# Altium schematic sheet ProcessorSupport.SchDoc
size 420 x 297 mm; SheetNumber: 7; SheetTotal: 10; PageSetup: Record=PageOptions|CenterHorizontal=True|CenterVertical=True|PrintScale=0.96|XCorrection=1.00|YCorrection=1.00|PrintKind=1|BorderSize=5000000|LeftOffset=0|BottomOffset=0|Orientation=2|PaperLength=4318|PaperWidth=2794|Scale=100|PaperSource=7|PrintQuality=600|MediaType=1|DitherType=10|PaperKind=11" x 17"|PrintScaleMode=1
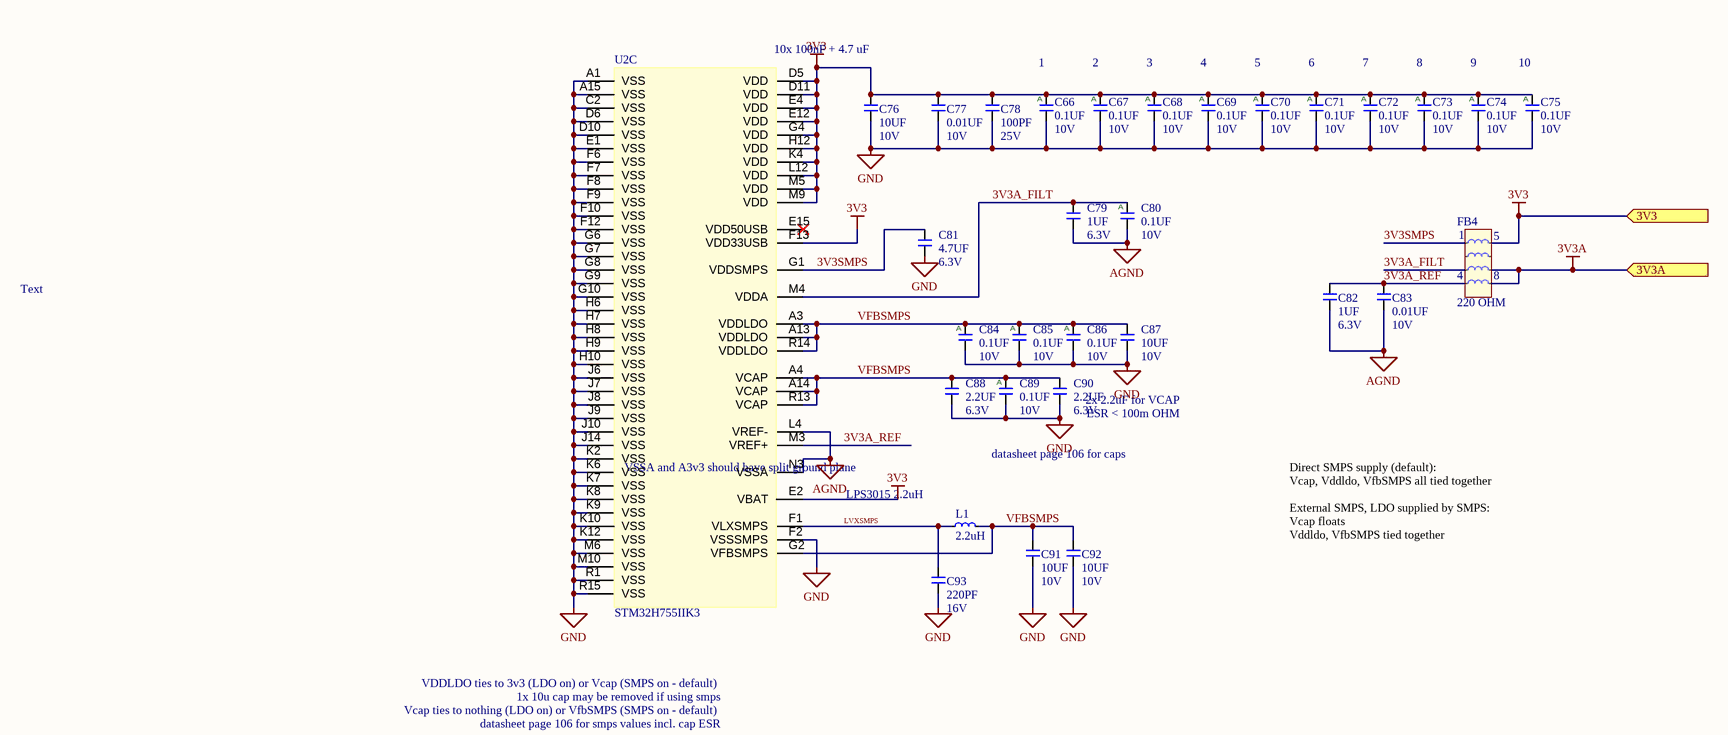
[diagram p0: ProcessorSupport.SchDoc]

## Parts
C66  value 0.1UF  Voltage: 10V  [C0201Y]  (hidden comment: __Template_Cap_Auto)
C67  value 0.1UF  Voltage: 10V  [C0201Y]  (hidden comment: __Template_Cap_Auto)
C68  value 0.1UF  Voltage: 10V  [C0201Y]  (hidden comment: __Template_Cap_Auto)
C69  value 0.1UF  Voltage: 10V  [C0201Y]  (hidden comment: __Template_Cap_Auto)
C70  value 0.1UF  Voltage: 10V  [C0201Y]  (hidden comment: __Template_Cap_Auto)
C71  value 0.1UF  Voltage: 10V  [C0201Y]  (hidden comment: __Template_Cap_Auto)
C72  value 0.1UF  Voltage: 10V  [C0201Y]  (hidden comment: __Template_Cap_Auto)
C73  value 0.1UF  Voltage: 10V  [C0201Y]  (hidden comment: __Template_Cap_Auto)
C74  value 0.1UF  Voltage: 10V  [C0201Y]  (hidden comment: __Template_Cap_Auto)
C75  value 0.1UF  Voltage: 10V  [C0201Y]  (hidden comment: __Template_Cap_Auto)
C76  value 10UF  Voltage: 10V  [C0402]  (hidden comment: __Template_Cap)
C77  value 0.01UF  Voltage: 10V  [C0201Y]  (hidden comment: __Template_Cap)
C78  value 100PF  Voltage: 25V  [C0201Y]  (hidden comment: __Template_Cap)
C79  value 1UF  Voltage: 6.3V  [C0201]  (hidden comment: __Template_Cap)
C80  value 0.1UF  Voltage: 10V  [C0201Y]  (hidden comment: __Template_Cap_Auto)
C81  value 4.7UF  Voltage: 6.3V  [C0402]  (hidden comment: __Template_Cap)
C82  value 1UF  Voltage: 6.3V  [C0201]  (hidden comment: __Template_Cap)
C83  value 0.01UF  Voltage: 10V  [C0201Y]  (hidden comment: __Template_Cap)
C84  value 0.1UF  Voltage: 10V  [C0201Y]  (hidden comment: __Template_Cap_Auto)
C85  value 0.1UF  Voltage: 10V  [C0201Y]  (hidden comment: __Template_Cap_Auto)
C86  value 0.1UF  Voltage: 10V  [C0201Y]  (hidden comment: __Template_Cap_Auto)
C87  value 10UF  Voltage: 10V  [C0402]  (hidden comment: __Template_Cap)
C88  value 2.2UF  Voltage: 6.3V  [C0201]  (hidden comment: __Template_Cap)
C89  value 0.1UF  Voltage: 10V  [C0201Y]  (hidden comment: __Template_Cap_Auto)
C90  value 2.2UF  Voltage: 6.3V  [C0201]  (hidden comment: __Template_Cap)
C91  value 10UF  Voltage: 10V  [C0402]  (hidden comment: __Template_Cap)
C92  value 10UF  Voltage: 10V  [C0402]  (hidden comment: __Template_Cap)
C93  value 220PF  Voltage: 16V  [C0201Y]  (hidden comment: __Template_Cap)
FB4  value 220 OHM  [FB_ARRAY_BLA31AG221SN4D]  (hidden comment: FB_ARRAY_BLA31AG221SN4D)
L1  value 2.2uH  [IND_LPS3015-152MRB]  (hidden comment: __Template_Inductor)
U2  MFG P/N: STM32H755IIK3  [BGS201C65P15X15_1000X1000X60]  (hidden comment: MCU_STM32H755IIK3)  (part C of 3)

## Ports
3V3 (in), 3V3A (in)

## Nets
3V3: C66.1 C67.1 C68.1 C69.1 C70.1 C71.1 C72.1 C73.1 C74.1 C75.1 C76.1 C77.1 C78.1 FB4.5 U2.D5(VDD) U2.D11(VDD) U2.E2(VBAT) U2.E4(VDD) U2.E12(VDD) U2.F13(VDD33USB) U2.G4(VDD) U2.H12(VDD) U2.K4(VDD) U2.L12(VDD) U2.M5(VDD) U2.M9(VDD) ; port 3V3
3V3A: FB4.7 FB4.8 ; port 3V3A
AGND: C79.2 C80.2 C82.2 C83.2 U2.L4(VREF-) U2.N3(VSSA)
GND: C66.2 C67.2 C68.2 C69.2 C70.2 C71.2 C72.2 C73.2 C74.2 C75.2 C76.2 C77.2 C78.2 C81.2 C84.2 C85.2 C86.2 C87.2 C88.2 C89.2 C90.2 C91.1 C92.1 C93.2 U2.A1(VSS) U2.A15(VSS) U2.C2(VSS) U2.D6(VSS) U2.D10(VSS) U2.E1(VSS) U2.F2(VSSSMPS) U2.F6(VSS) U2.F7(VSS) U2.F8(VSS) U2.F9(VSS) U2.F10(VSS) U2.F12(VSS) U2.G6(VSS) U2.G7(VSS) U2.G8(VSS) U2.G9(VSS) U2.G10(VSS) U2.H6(VSS) U2.H7(VSS) U2.H8(VSS) U2.H9(VSS) U2.H10(VSS) U2.J6(VSS) U2.J7(VSS) U2.J8(VSS) U2.J9(VSS) U2.J10(VSS) U2.J14(VSS) U2.K2(VSS) U2.K6(VSS) U2.K7(VSS) U2.K8(VSS) U2.K9(VSS) U2.K10(VSS) U2.K12(VSS) U2.M6(VSS) U2.M10(VSS) U2.R1(VSS) U2.R15(VSS)
3V3A_FILT: C79.1 C80.1 FB4.3 U2.M4(VDDA)
3V3A_REF: C82.1 C83.1 FB4.4 U2.M3(VREF+)
3V3SMPS: C81.1 FB4.1 U2.G1(VDDSMPS)
LVXSMPS: C93.1 L1.1 U2.F1(VLXSMPS)
VFBSMPS: C84.1 C85.1 C86.1 C87.1 C88.1 C89.1 C90.1 C91.2 C92.2 L1.2 U2.A3(VDDLDO) U2.A4(VCAP) U2.A13(VDDLDO) U2.A14(VCAP) U2.G2(VFBSMPS) U2.R13(VCAP) U2.R14(VDDLDO)

Not connected (* = marked no-connect by the designer): FB4 2 6; U2 E15(VDD50USB)*

## Notes on the sheet
- 10x 100nF + 4.7 uF
- (near C66) 1
- (near C67) 2
- (near C68) 3
- (near C69) 4
- (near C70) 5
- (near C71) 6
- (near C72) 7
- (near C73) 8
- (near C74) 9
- (near C75) 10
- Text
- 2x 2.2uF for VCAP
- VSSA and A3v3 should have split ground plane
- datasheet page 106 for caps
- ESR < 100m OHM
- (near L1) LPS3015 2.2uH
- Direct SMPS supply (default):
  Vcap, Vddldo, VfbSMPS all tied together
  External SMPS, LDO supplied by SMPS:
  Vcap floats
  Vddldo, VfbSMPS tied together
- VDDLDO ties to 3v3 (LDO on) or Vcap (SMPS on - default)
- Vcap ties to nothing (LDO on) or VfbSMPS (SMPS on - default)
- 1x 10u cap may be removed if using smps
- datasheet page 106 for smps values incl. cap ESR
- CREATIVE COMMONS
- PUBLIC LICENSE:
- BARKOUR ROBOT
- CC BY-NC 4.0
- APPROVED
- DWG NO
- GOOGLE LLC
- FILE
- RELEASED
- 2024/05/09
- SIZE
- 1600 AMPHITHEATRE PARKWAY
- MOUNTAIN VIEW CA 94043
- A3
- SHEET
- OF
- THIS DESIGN IS BEING PROVIDED  FOR NON-COMMERCIAL USE ONLY. THE USE OF =SCIENTIST_NAME_POSSESSIVE NAME IN CONNECTION WITH THE DESIGN IS NOT INTENDED TO IMPLY THAT =SCIENTIST_NAME SPONSORS OR ENDORSES THE DESIGN, GOOGLE LLC, OR ANY OF GOOGLE LLC'S PRODUCTS OR SERVICES.
- (in symbol 934) A

## Library data of the parts
C66-C75 C80 C84-C86 C89 = 934: CAP, CER, X6S, 0.1uF, 10V, 10%, 0201, AUTOGRADE; ID: 934; MFG: MURATA; MFG P/N: GRT033C81A104KE01D; XPN: 150-01178-00; Gecko: 150-04546-00; EES: 150-04563-00; Status: Released; Package: 0201; Dielectric: X6S; Tolerance: 10%; Height: 0.33mm T; Supplier 1: Digi-key; HelpURL: https://www.digikey.com/product-detail/en/murata-electronics/GRT033C81A104KE01D/490-12232-1-ND/5416933; ComponentLink1Description: Datasheet; ComponentLink1URL: https://search.murata.co.jp/Ceramy/image/img/A01X/G101/ENG/GRT033C81A104KE01-01.pdf; COMMON: 150-01178-00; LOON: 150-01178-00; Supplier Part Number 1: 490-12232-1-ND
C76 C87 C91 C92 = 215: CAP, CER, X5R, 10uF, 10V, 20%, 0402, 0.7mm T; ID: 215; MFG: SAMSUNG; MFG P/N: CL05A106MP5NUNC; XPN: 150-00376-00; PROXY: Use ID #1342; EES: 150-04565-00; Status: Released; Package: 0402; Dielectric: X5R; Tolerance: 20%; Height: 0.7mm T; ComponentLink1Description: Datasheet; COMMON: 150-00376-00; LOON: 150-00376-00; Gecko: 150-00376-00
C77 C83 = 361: CAP, CER, X7R, 0.01uF, 10V, 10%, AUTO GRADE, 0201, 0.33mm T; ID: 361; MFG: MURATA; MFG P/N: GCM033R71A103KA03D; XPN: 150-01021-00; EES: 150-04564-00; Status: Released; Package: 0201; Dielectric: X7R; Tolerance: 10%; Height: 0.33mm T; ComponentLink1Description: Datasheet; COMMON: 150-01021-00; LOON: 150-01021-00; Gecko: 150-01021-00
C78 = 767: CAP, CER, X7R, 100pF, 25V, 10%, 0201, 0.33mm T; ID: 767; MFG: MURATA; MFG P/N: GRM033R71E101KA01D; XPN: 150-00022-00; EES: 150-04573-00; Status: Released; Package: 0201; Dielectric: X7R; Tolerance: 10%; Height: 0.33mm T; ComponentLink1Description: Datasheet; COMMON: 150-00022-00; LOON: 150-00022-00; Gecko: 150-00022-00
C79 C82 = 240: CAP, CER, X5R, 1uF, 6.3V, 20%, 0201, 0.33mm T; ID: 240; MFG: SAMSUNG; MFG P/N: CL03A105MQ3CSNC; XPN: 150-00980-00; EPIC: G150-00980-00; EES: 150-04572-00; Status: Released; Package: 0201; Dielectric: X5R; Tolerance: 20%; Height: 0.35mm; ComponentLink1Description: Datasheet; COMMON: 150-00980-00; LOON: 150-00980-00; Gecko: 150-00980-00
C81 = 50: CAP, CER, X5R, 4.7uF, 20%, 6.3V, 0402, 0.65mm; ID: 50; MFG: TDK; MFG P/N: C1005X5R0J475M050BC; XPN: 150-00023-00; PROXY: Use ID #1662; EES: 150-04574-00; Status: Released; Package: 0402; Dielectric: X5R; Tolerance: 20%; Height: 0.65mm; ComponentLink1Description: Datasheet; COMMON: 150-00023-00; LOON: 150-00023-00; Gecko: 150-00023-00
C88 C90 = 110: CAP, CER, X5R, 2.2uF, 6.3V, 20%, 0201, 0.39mm T; ID: 110; MFG: SAMSUNG; MFG P/N: CL03A225MQ3CRNC; XPN: 150-00421-00; EPIC: G150-00421-00; EES: 150-04575-00; Status: Released; Package: 0201; Dielectric: X5R; Tolerance: 20%; Height: 0.39mm T; ComponentLink1Description: Datasheet; COMMON: 150-00421-00; LOON: 150-00421-00; Gecko: 150-00421-00
C93 = 156: CAP, CER, X7R, 220pF, 16V, 10%, 0201, 0.33mm T; ID: 156; MFG: MURATA; MFG P/N: GRM033R71C221KA01D; XPN: 150-00794-00; EES: 150-04568-00; Status: Released; Package: 0201; Dielectric: X7R; Tolerance: 10%; Height: 0.33mm T; ComponentLink1Description: Datasheet; COMMON: 150-00794-00; LOON: 150-00794-00; Gecko: 150-00794-00
FB4 = 937: FERRITE, BEAD, 220 OHM, 150mA, DCR 0.25 MAX, 1206; ID: 937; Catagory: FB- 8-Pin Array; MFG: Murata Electronics; Rdc max: 250mOhm; EES: 185-00324-00; ComponentLink1Description: Datasheet; Status: Released; MFG P/N: BLA31AG221SN4D; Package: 1206-Array; Idc max: 150mA; Supplier 1: Digi-Key; HelpURL: https://www.digikey.com/product-detail/en/murata-electronics/BLA31AG221SN4D/490-9700-1-ND/4934839; ComponentLink1URL: https://www.murata.com/en-us/products/productdata/8796743204894/ENFA0008.pdf; Height: 1mm; Supplier Part Number 1: 490-9700-1-ND
L1 = 939: IND, WIREWOUND, SHIELDED, 2.2uH, 2.1A, 20%, DCR 0.11, SMD, AUTOGRADE; ID: 939; Catagory: Fixed Inductors; MFG: COILCRAFT; MFG P/N: LPS3015-222MR_; Rdc max: 110mOhms; EES: 180-02234-00; ComponentLink1Description: Datasheet; Status: Released; Package: 2 - pin SMD; Tolerance: 20%; Idc max: 2.1 A; Supplier 1: Digi-Key; HelpURL: https://www.digikey.com/products/en?keywords=LPS3015-222MR_; ComponentLink1URL: https://www.coilcraft.com/getmedia/5d262731-85ef-4348-8ab4-1044b4fc3cb8/lps3015.pdf; Height: 1.5mm; Supplier Part Number 1: 2457-LPS3015-222MR_TR-ND
U2 = 112: IC, MCU, STM32H755xI, ARM, 32-BIT, 240MHZ, 128 I/O, 2MB, FLASH, 1.62V TO 3.6V, UFBGA-201; ID: 112; MFG: STMicroelectronics; EES: 313-05804-00; Status: Released; Package: 176+25UFBGA (10x10); Category: Integrated Circuits (ICs); RoHS Compliant: Yes; Supplier 1: Digi-Key; HelpURL: https://www.digikey.com/products/en?keywords=STM32H755IIK3; ComponentLink1Description: Datasheet; ComponentLink1URL: https://www.st.com/resource/en/datasheet/stm32h755ii.pdf; Height: 0.6mm; Supplier Part Number 1: 497-STM32H755IIK3-ND